# Altium schematic sheet LDR.schdoc
size 127 x 101 mm
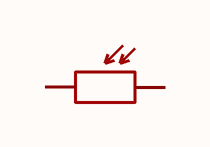
[diagram p0: LDR.schdoc]

## Parts
R?  GT36528  [RES-SMD_L3.6-W2.4]  (value not drawn)

## Nets

Not connected (* = marked no-connect by the designer): R? 1 2

## Library data of the parts
R? = GT36528: Manufacturer: JCHL(晶创和立); Add into BOM: yes; Symbol: GT36528; Device: GT36528; LCSC Part Name: GT36528; Supplier Part: C2904881; Manufacturer Part: GT36528; Supplier Footprint: SMD,2.4x3.6mm; JLCPCB Part Class: Extended Part; Datasheet: https://atta.szlcsc.com/upload/public/pdf/source/20211014/6AB64DE2EFA295B23F73ED070F69DE44.pdf; Supplier: LCSC; Convert to PCB: yes